# EAGLE design refSpoj (EAGLE 7.2.0)
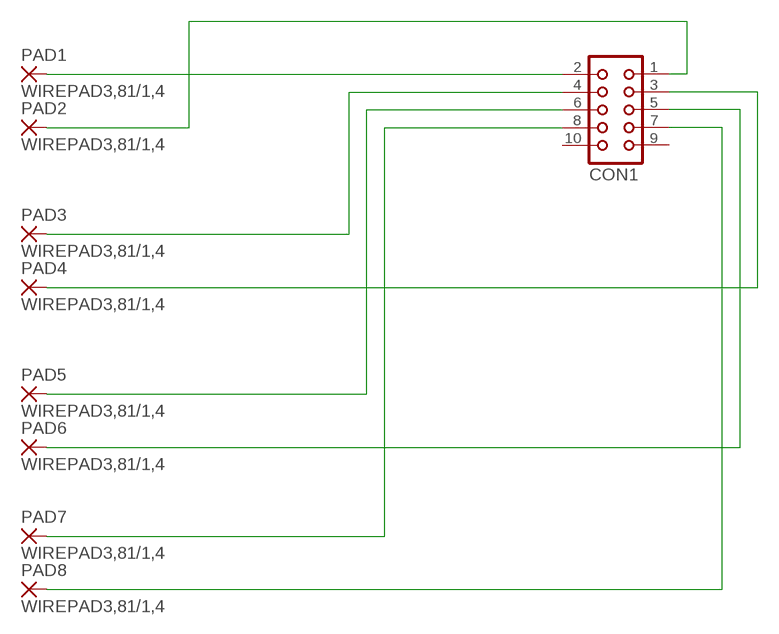
[diagram p0: schematic, sheet 1]

## Parts
CON1  CON10  [CON10]
PAD1  WIREPAD3,81/1,4  [3,81/1,4]
PAD2  WIREPAD3,81/1,4  [3,81/1,4]
PAD3  WIREPAD3,81/1,4  [3,81/1,4]
PAD4  WIREPAD3,81/1,4  [3,81/1,4]
PAD5  WIREPAD3,81/1,4  [3,81/1,4]
PAD6  WIREPAD3,81/1,4  [3,81/1,4]
PAD7  WIREPAD3,81/1,4  [3,81/1,4]
PAD8  WIREPAD3,81/1,4  [3,81/1,4]

## Nets
N$1: CON1.2 PAD1.1(P)
N$2: CON1.1 PAD2.1(P)
N$3: CON1.4 PAD3.1(P)
N$4: CON1.3 PAD4.1(P)
N$5: CON1.6 PAD5.1(P)
N$6: CON1.5 PAD6.1(P)
N$7: CON1.8 PAD7.1(P)
N$8: CON1.7 PAD8.1(P)
Unconnected: CON1.9 CON1.10

## Library data of the parts
CON1 = con-harting:CON10: CONNECTOR; OC_FARNELL: unknown; OC_NEWARK: unknown
PAD1-PAD8 = wirepad:WIREPAD: Wire PAD connect wire on PCB

## Board
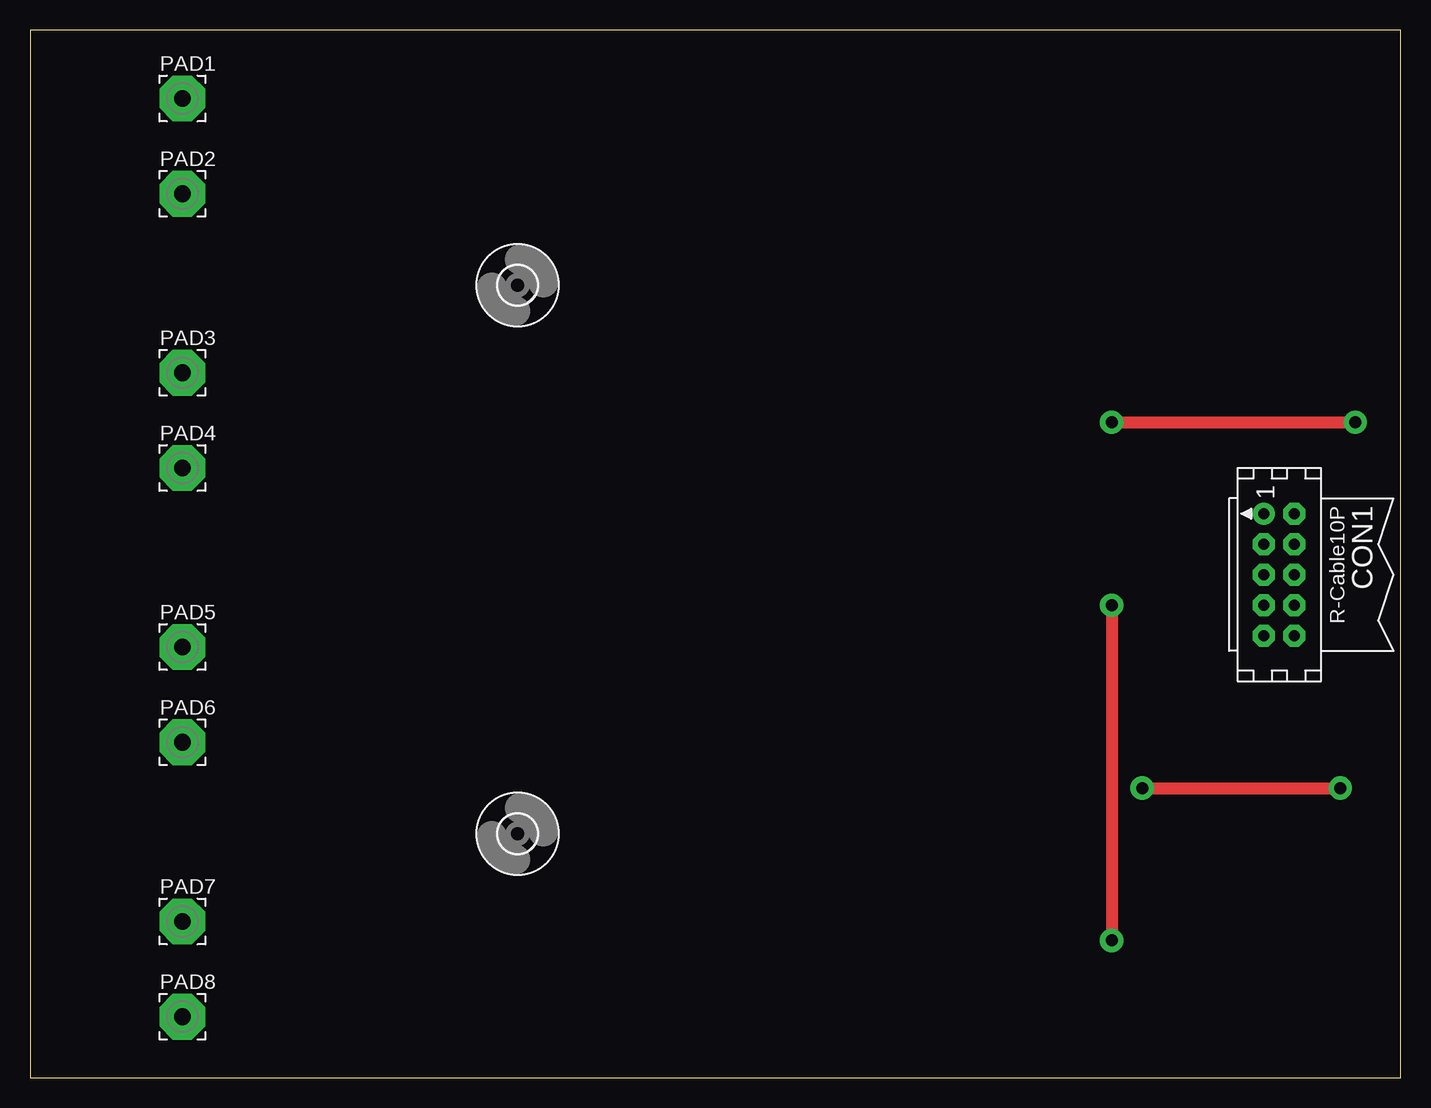
[diagram p1: board, top side]
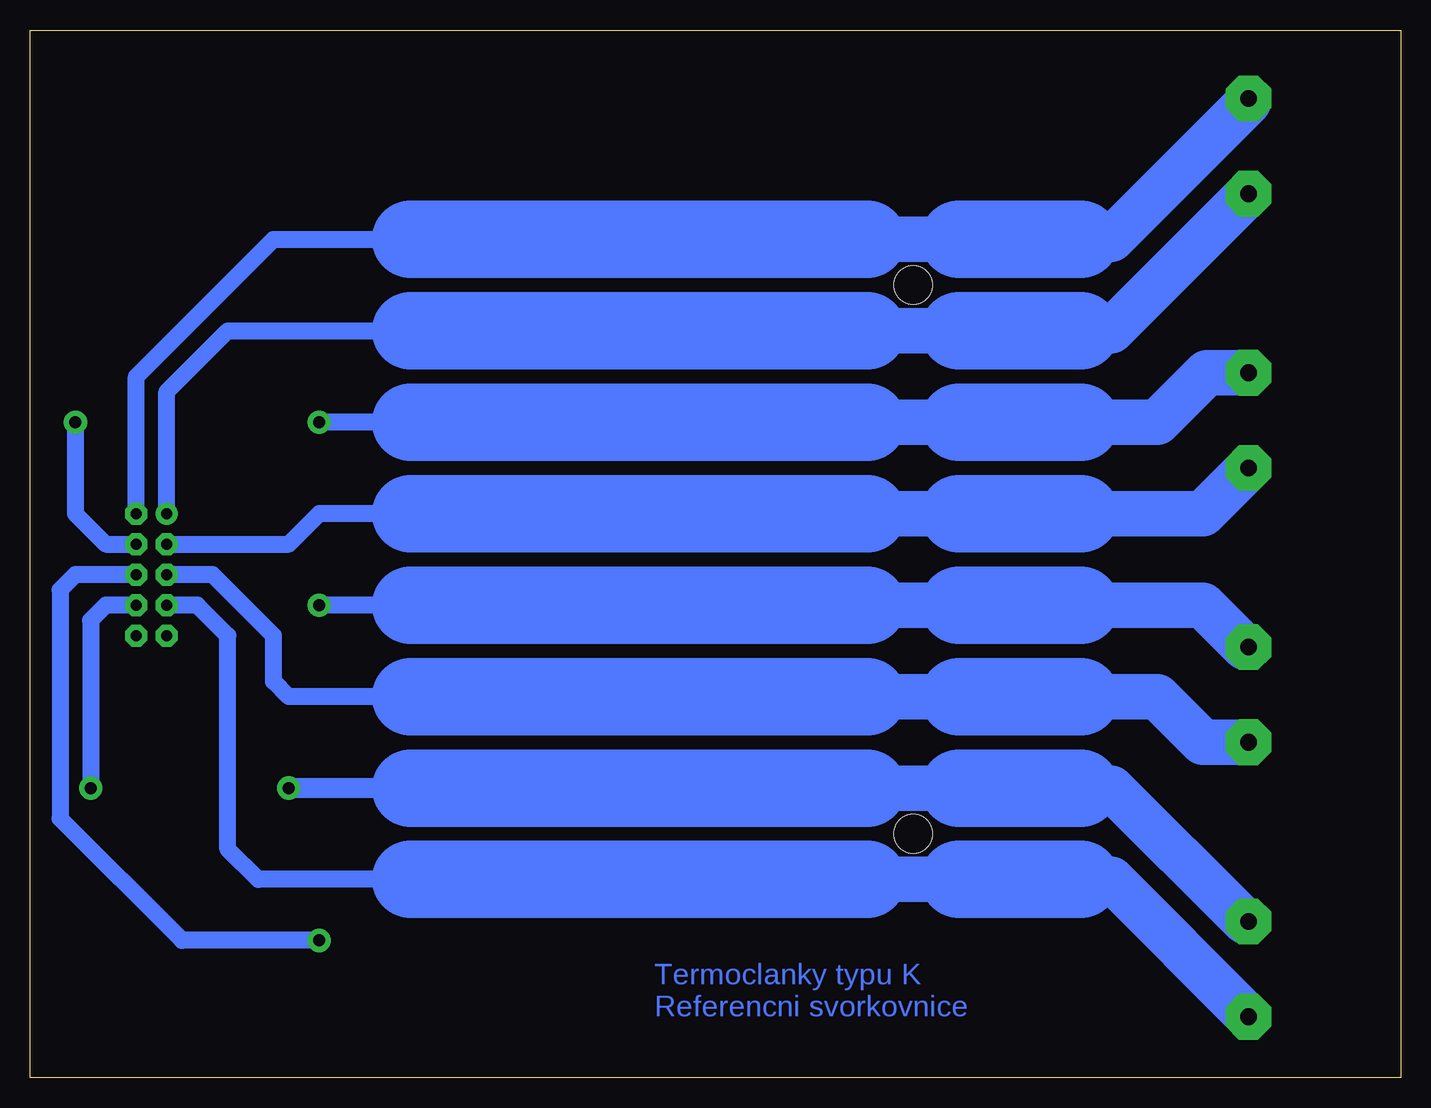
[diagram p2: board, bottom side, seen from below]

Size 114.28 x 87.3 mm. Coordinates in mm from the lower left corner, seen from the top.
Outline: 0,0 114.28,0 114.28,87.3 0,87.3 0,0
Copper layers (1*16): Top 0.035mm / dielectric 1.5mm / Bottom 0.035mm
Design rules "default *": minimum track width 10mil, minimum drill 24mil, track to track 8mil, track to pad 8mil, pad to pad 8mil, via to via 8mil, smd to smd 8mil, copper to edge 40mil, drill to drill 8mil, minimum pad ring 15mil, minimum via ring 8mil, stop-mask expansion 4mil, vias tented up to drill 0mil, thermal gap 10mil

### Footprints (pad centres in the part's own frame; a part is rotated, then mirrored left to right if it is on the bottom)
CON10 = drill 0.914: 1 -5.08,-1.27 | drill 0.914 octagon: 2 -5.08,1.27; 3 -2.54,-1.27; 4 -2.54,1.27; 5 0,-1.27; 6 0,1.27; 7 2.54,-1.27; 8 2.54,1.27; 9 5.08,-1.27; 10 5.08,1.27
3,81/1,4 = drill 1.397 pad 3.81 octagon: 1 0,0
3,2 = hole 3.2: 0,0

### Placement (x,y rotation side)
CON1  104.14,41.91 270 top
PAD1  12.7,81.6 0 top
PAD2  12.7,73.66 0 top
PAD3  12.7,58.74 0 top
PAD4  12.7,50.8 0 top
PAD5  12.7,35.88 0 top
PAD6  12.7,27.94 0 top
PAD7  12.7,13.02 0 top
PAD8  12.7,5.08 0 top
U$1  [3,2]  40.64,20.32 0 top
U$2  [3,2]  40.64,66.04 0 top

### Tracks (layer width: path | path; a pad name or v marks a point on that pad's centre or on a via)
N$1
  Bottom 1.016: PAD1.1 12.7,81.28
  Bottom 1.422: CON1.2 105.41,58.42 93.98,69.85 82.55,69.85
  Bottom 3.81: 12.7,81.28 24.13,69.85 26.67,69.85 | 36.83,69.85 44.45,69.85
  Bottom 6.452: 26.67,69.85 36.83,69.85 | 44.45,69.85 82.55,69.85
N$2
  Bottom 1.422: CON1.1 102.87,57.15 97.79,62.23 82.55,62.23
  Bottom 3.81: PAD2.1 24.13,62.23 26.67,62.23 | 36.83,62.23 44.45,62.23
  Bottom 6.452: 26.67,62.23 36.83,62.23 | 44.45,62.23 82.55,62.23
N$3  (via drill 1 pad 1.93)
  Top 1.016: v90.17,54.61 v110.49,54.61
  Bottom 1.422: 82.55,54.61 v90.17,54.61 | v110.49,54.61 110.49,46.99 107.95,44.45 CON1.4
  Bottom 3.81: PAD3.1 16.19,58.74 20.32,54.61 26.67,54.61 | 36.83,54.61 44.45,54.61
  Bottom 6.452: 26.67,54.61 36.83,54.61 | 44.45,54.61 82.55,54.61
N$4
  Bottom 1.422: CON1.3 92.71,44.45 90.17,46.99 82.55,46.99
  Bottom 3.81: PAD4.1 16.51,46.99 26.67,46.99 | 36.83,46.99 44.45,46.99
  Bottom 6.452: 26.67,46.99 36.83,46.99 | 44.45,46.99 82.55,46.99
N$5  (via drill 1 pad 1.93)
  Top 1.016: v90.17,39.37 v90.17,11.43
  Bottom 1.422: 82.55,39.37 v90.17,39.37 | v90.17,11.43 101.6,11.43 111.76,21.59 111.76,40.64 110.49,41.91 CON1.6
  Bottom 3.81: PAD5.1 13.02,35.88 16.51,39.37 26.67,39.37 | 36.83,39.37 44.45,39.37
  Bottom 6.452: 26.67,39.37 36.83,39.37 | 44.45,39.37 82.55,39.37
N$6
  Bottom 1.422: CON1.5 99.06,41.91 93.98,36.83 93.98,33.02 92.71,31.75 82.55,31.75
  Bottom 3.81: PAD6.1 16.51,27.94 20.32,31.75 26.67,31.75 | 36.83,31.75 44.45,31.75
  Bottom 6.452: 26.67,31.75 36.83,31.75 | 44.45,31.75 82.55,31.75
N$7  (via drill 1 pad 1.93)
  Top 1.016: v92.71,24.13 v109.22,24.13
  Bottom 1.016: PAD7.1 13.02,13.02
  Bottom 1.422: CON1.8 107.95,39.37 109.22,38.1 v109.22,24.13
  Bottom 1.676: 82.55,24.13 v92.71,24.13
  Bottom 3.81: 13.02,13.02 24.13,24.13 26.67,24.13 | 36.83,24.13 44.45,24.13
  Bottom 6.452: 26.67,24.13 36.83,24.13 | 44.45,24.13 82.55,24.13
N$8
  Bottom 1.422: CON1.7 100.33,39.37 97.79,36.83 97.79,19.05 95.25,16.51 82.55,16.51
  Bottom 3.81: PAD8.1 24.13,16.51 26.67,16.51 | 36.83,16.51 44.45,16.51
  Bottom 6.452: 26.67,16.51 36.83,16.51 | 44.45,16.51 82.55,16.51

### Text on the board
Bottom: Termoclanky typu K / Referencni svorkovnice